# EAGLE design PIC32 (EAGLE 7.5.0)
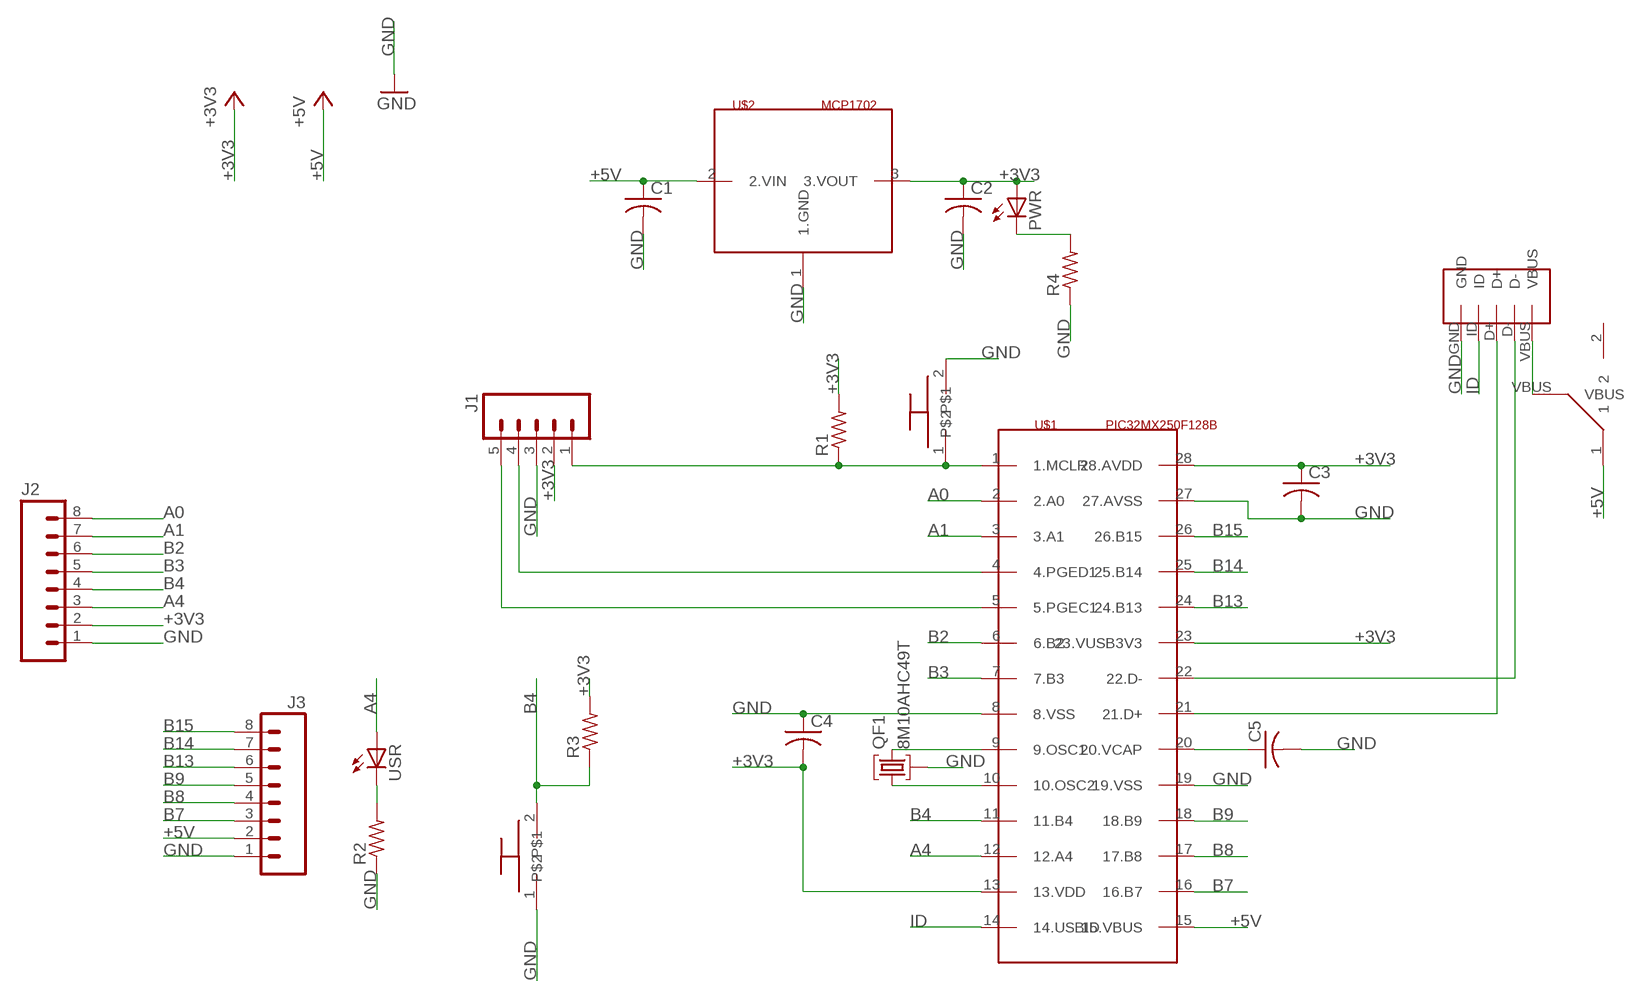
[diagram p0: schematic, sheet 1]

## Parts
C1  C-US025-024X044  [C025-024X044]
C2  C-US025-024X044  [C025-024X044]
C3  C-US025-024X044  [C025-024X044]
C4  C-US025-024X044  [C025-024X044]
C5  C-US025-030X050  [C025-030X050]
J1  M05PTH  [1X05]
J2  M08  [1X08_ROUND]
J3  M08  [1X08_ROUND]
PWR  LED3MM  [LED3MM]
QF1  8M10AHC49T  [HC49U]
R1  R-US_0207/10  [0207/10]
R2  R-US_0207/10  [0207/10]
R3  R-US_0207/10  [0207/10]
R4  R-US_0207/10  [0207/10]
RESET  PUSHBUTTON  [PUSHBUTTON]
U$1  PIC32MX250F128B  [DIL28-3]
U$2  MCP1702  [TO92-EBC]
U$4  USB  [USB-MB-H]
U$6  SLIDESWITCH  [SLIDESWITCH]
USER  PUSHBUTTON  [PUSHBUTTON]
USR  LED3MM  [LED3MM]

## Nets
+3V3: C2.1 C3.1 C4.2 J1.2 J2.2 PWR.A R1.2 R3.2 U$1.13(13.VDD) U$1.23(23.VUSB3V3) U$1.28(28.AVDD) U$2.3(3.VOUT)
+5V: C1.1 J3.2 U$1.15(15.VBUS) U$2.2(2.VIN) U$6.1
A0: J2.8 U$1.2(2.A0)
A1: J2.7 U$1.3(3.A1)
A4: J2.3 U$1.12(12.A4) USR.A
B2: J2.6 U$1.6(6.B2)
B3: J2.5 U$1.7(7.B3)
B4: J2.4 R3.1 U$1.11(11.B4) USER.2
B7: J3.3 U$1.16(16.B7)
B8: J3.4 U$1.17(17.B8)
B9: J3.5 U$1.18(18.B9)
B13: J3.6 U$1.24(24.B13)
B14: J3.7 U$1.25(25.B14)
B15: J3.8 U$1.26(26.B15)
GND: C1.2 C2.2 C3.2 C4.1 C5.2 J1.3 J2.1 J3.1 QF1.2 R2.1 R4.1 RESET.2 U$1.8(8.VSS) U$1.19(19.VSS) U$1.27(27.AVSS) U$2.1(1.GND) U$4.GND USER.1
ID: U$1.14(14.USBID) U$4.ID
N$1: J1.1 R1.1 RESET.1 U$1.1(1.MCLR)
N$2: J1.4 U$1.4(4.PGED1)
N$3: J1.5 U$1.5(5.PGEC1)
N$4: QF1.1 U$1.10(10.OSC2)
N$5: C5.1 U$1.20(20.VCAP)
N$6: R2.2 USR.K(C)
N$7: U$4.VBUS U$6.VBUS
N$8: QF1.3 U$1.9(9.OSC1)
N$9: U$1.21(21.D+) U$4.D+
N$10: U$1.22(22.D-) U$4.D-
N$11: PWR.K(C) R4.2
Unconnected: U$6.2

## Library data of the parts
C1-C5 = ME433:C-US: CAPACITOR, American symbol
J1 = ME433:M05: Header 5 Standard 5-pin 0.1" header. Use with straight break away headers (SKU : PRT-00116), right angle break away headers (PRT-00553), swiss pins (PRT-00743), machine pins (PRT-00117), and female headers (PRT-00115). Molex polarized connector foot print use with SKU : PRT-08230 with associated crimp pins and housings.
J2 J3 = ME433:M08: Header 8 Standard 8-pin 0.1" header. Use with straight break away headers (SKU : PRT-00116), right angle break away headers (PRT-00553), swiss pins (PRT-00743), machine pins (PRT-00117), and female headers (PRT-00115).; PROD_ID: CONN-08437
PWR USR = led:LED: LED OSRAM: - CHIPLED LG R971, LG N971, LY N971, LG Q971, LY Q971, LO R971, LY R971 LH N974, LH R974 LS Q976, LO Q976, LY Q976 LO Q996 - Hyper CHIPLED LW Q18S LB Q993, LB Q99A, LB R99A - SideLED LS A670, LO A670, LY A670, LG A670, LP A670 LB A673, LV A673, LT A673, LW A673 LH A674 LY A675 LS A676, LA A676, LO A676, LY A676, LW A676 LS A679, LY A679, LG A679 - Hyper Micro SIDELED® LS Y876, LA Y876, LO Y876, LY Y876 LT Y87S - SmartLED LW L88C, LW L88S LB L89C, LB L89S, LG L890 LS L89K, LO L89K, LY L89K LS L896, LA L896, LO L896, LY L896 - TOPLED LS T670, LO T670, LY T670, LG T670, LP T670 LSG T670, LSP T670, LSY T670, LOP T670, LYG T670 LG T671, LOG T671, LSG T671 LB T673, LV T673, LT T673, LW T673 LH T674 LS T676, LA T676, LO T676, LY T676, LB T676, LH T676, LSB T676, LW T676 LB T67C, LV T67C, LT T67C, LS T67K, LO T67K, LY T67K, LW E67C LS E67B, LA E67B, LO E67B, LY E67B, LB E67C, LV E67C, LT E67C LW T67C LS T679, LY T679, LG T679 LS T770, LO T770, LY T770, LG T770, LP T770 LB T773, LV T773, LT T773, LW T773 LH T774 LS E675, LA E675, LY E675, LS T675 LS T776, LA T776, LO T776, LY T776, LB T776 LHGB T686 LT T68C, LB T68C - Hyper Mini TOPLED® LB M676 - Mini TOPLED Santana® LG M470 LS M47K, LO M47K, LY M47K Source: http://www.osram.convergy.de LUXEON: - LUMILED® LXK2-PW12-R00, LXK2-PW12-S00, LXK2-PW14-U00, LXK2-PW14-V00 LXK2-PM12-R00, LXK2-PM12-S00, LXK2-PM14-U00 LXK2-PE12-Q00, LXK2-PE12-R00, LXK2-PE12-S00, LXK2-PE14-T00, LXK2-PE14-U00 LXK2-PB12-K00, LXK2-PB12-L00, LXK2-PB12-M00, LXK2-PB14-N00, LXK2-PB14-P00, LXK2-PB14-Q00 LXK2-PR12-L00, LXK2-PR12-M00, LXK2-PR14-Q00, LXK2-PR14-R00 LXK2-PD12-Q00, LXK2-PD12-R00, LXK2-PD12-S00 LXK2-PH12-R00, LXK2-PH12-S00 LXK2-PL12-P00, LXK2-PL12-Q00, LXK2-PL12-R00 Source: www.luxeon.com KINGBRIGHT: KA-3528ASYC Source: www.kingbright.com
QF1 = ME433:8M10AHC49T: Monolithic Crystal Filters Source: www.vanlong.com; OC_FARNELL: unknown; OC_NEWARK: unknown
R1-R4 = ME433:R-US_: RESISTOR, American symbol
RESET USER = ME433:PUSHBUTTON
U$1 = ME433:PIC32MX250F128B
U$2 = ME433:MCP1702
U$4 = ME433:USB
U$6 = ME433:SLIDESWITCH

## Board
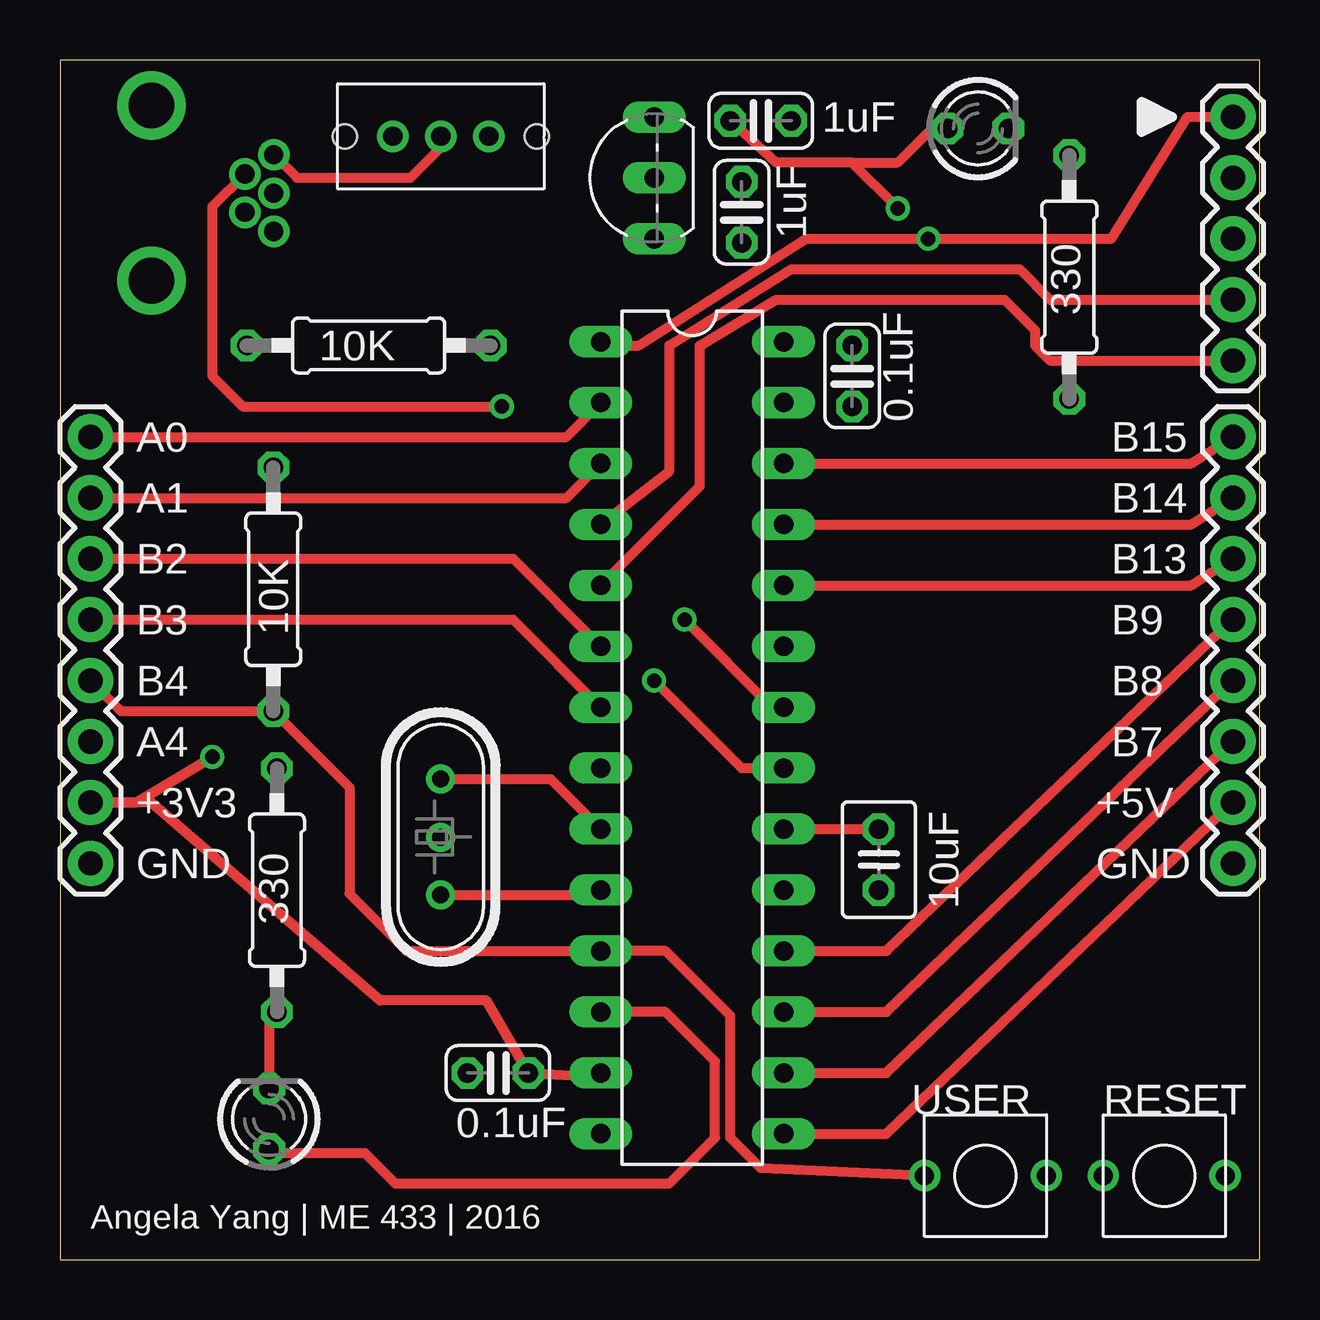
[diagram p1: board, top side]
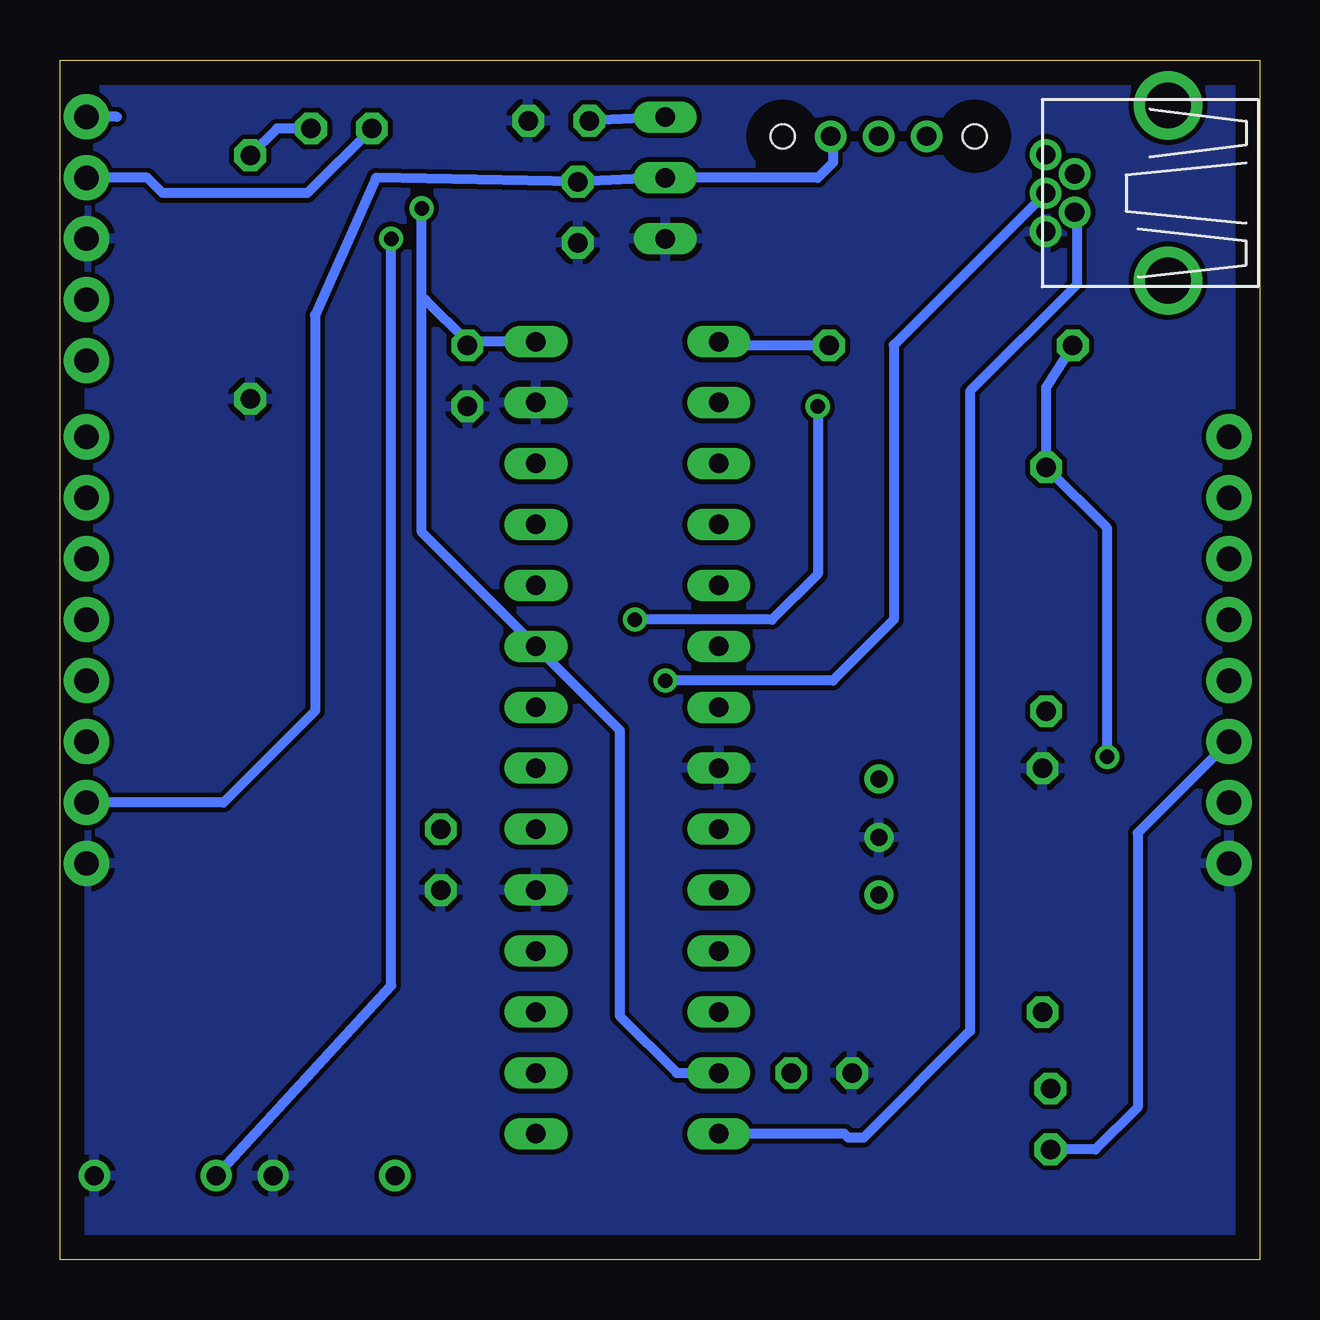
[diagram p2: board, bottom side, seen from below]

Size 50 x 50 mm. Coordinates in mm from the lower left corner, seen from the top.
Outline: 0,0 50,0 50,50 0,50 0,0
Copper layers (1*16): Top 0.035mm / dielectric 1.5mm / Bottom 0.035mm
Design rules "default": minimum track width 10mil, minimum drill 24mil, track to track 8mil, track to pad 8mil, pad to pad 8mil, via to via 8mil, smd to smd 8mil, copper to edge 40mil, drill to drill 8mil, minimum pad ring 10mil, minimum via ring 8mil, stop-mask expansion 4mil, vias tented up to drill 0mil, thermal gap 10mil

### Footprints (pad centres in the part's own frame; a part is rotated, then mirrored left to right if it is on the bottom)
C025-024X044 = drill 0.813 octagon: 1 -1.27,0; 2 1.27,0
C025-030X050 = drill 0.813 octagon: 1 -1.27,0; 2 1.27,0
1X05 = drill 1.016 pad 1.88: 1 0,0; 2 2.54,0; 3 5.08,0; 4 7.62,0; 5 10.16,0
1X08_ROUND = drill 1.016 pad 1.88: 1 0,0; 2 2.54,0; 3 5.08,0; 4 7.62,0; 5 10.16,0; 6 12.7,0; 7 15.24,0; 8 17.78,0
LED3MM = drill 0.813 octagon: A -1.27,0; K 1.27,0
HC49U = drill 0.7 pad 1.2: 1 -2.413,0; 2 -0.027,0; 3 2.413,0
0207/10 = drill 0.813 octagon: 1 -5.08,0; 2 5.08,0
PUSHBUTTON = drill 0.8: 1 -2.54,0; 2 2.54,0
DIL28-3 = drill 0.813 long: 1 -16.51,-3.81; 2 -13.97,-3.81; 3 -11.43,-3.81; 4 -8.89,-3.81; 5 -6.35,-3.81; 6 -3.81,-3.81; 7 -1.27,-3.81; 8 1.27,-3.81; 9 3.81,-3.81; 10 6.35,-3.81; 11 8.89,-3.81; 12 11.43,-3.81; 13 13.97,-3.81; 14 16.51,-3.81; 15 16.51,3.81; 16 13.97,3.81; 17 11.43,3.81; 18 8.89,3.81; 19 6.35,3.81; 20 3.81,3.81; 21 1.27,3.81; 22 -1.27,3.81; 23 -3.81,3.81; 24 -6.35,3.81; 25 -8.89,3.81; 26 -11.43,3.81; 27 -13.97,3.81; 28 -16.51,3.81
TO92-EBC = drill 0.813 long: 1 -2.54,-1.27; 2 0,-1.27; 3 2.54,-1.27
USB-MB-H = drill 0.8: D+ 5.1,0; D- 3.9,0.8; GND 5.1,-1.6; ID 3.9,-0.8; VBUS 5.1,1.6 | drill 1.9: P$6 0,-3.65; P$7 0,3.65
SLIDESWITCH = drill 0.8: 1 -2,0; 2 2,0; VBUS 0,0 | hole 1: -4,0; 4,0

### Placement (x,y rotation side)
C1  28.41,43.66 270 top
C2  29.21,47.47 0 top
C3  33.02,36.83 270 top
C4  18.25,7.78 0 top
C5  34.13,16.67 270 top
J1  48.9,47.63 270 top
J2  1.27,16.51 90 top
J3  48.9,16.51 90 top
PWR  38.27,47.15 0 top
QF1  15.87,17.61 90 top
R1  12.87,38.1 180 top
R2  9.04,15.39 270 top
R3  8.89,27.94 90 top
R4  42.07,40.95 90 top
RESET  46.03,3.5 0 top
U$1  26.35,21.75 270 top
U$2  23.5,45.09 90 top
U$4  3.81,44.45 0 top
U$6  15.88,46.82 180 top
USER  38.58,3.5 180 top
USR  8.71,5.86 90 top

### Tracks (layer width: path | path; a pad name or v marks a point on that pad's centre or on a via)
+3V3  (via drill 0.6)
  Top 0.406: U$1.13 22.38,7.62 C4.2 17.78,10.79 13.34,10.79 3.81,19.05 J2.2 3.17,19.05 v6.35,20.95 | C2.1 29.84,45.72 33.02,45.72 | 33.02,45.72 34.92,45.72 36.35,47.15 PWR.A | v34.92,43.81 33.02,45.72
  Bottom 0.406: U$1.28 33.02,38.26 | 33.02,38.26 C3.1 | R1.2 8.89,36.36 R3.2 6.35,30.48 v6.35,20.95 | U$2.3 C2.1 | PWR.A 39.69,44.45 45.72,44.45 46.36,45.09 J1.2 | U$1.13 24.29,7.78 26.67,10.16 26.67,22.07 U$1.23 34.92,30.32 34.92,40 | 34.92,40 v34.92,43.81 | 33.02,38.26 34.76,40 34.92,40
+5V
  Top 0.406: U$1.15 34.45,5.24 J3.2
  Bottom 0.406: U$6.1 17.78,46.73 17.78,45.72 18.41,45.09 U$2.2 C1.1 36.83,45.09 39.37,39.37 39.37,22.86 43.18,19.05 J3.2
A0
  Top 0.406: J2.8 21.11,34.29 U$1.2
A1
  Top 0.406: J2.7 21.11,31.75 U$1.3
A4
  Top 0.406: USR.A 8.86,4.45 12.7,4.45 13.97,3.17 25.4,3.17 27.3,5.08 27.3,8.26 25.24,10.32 U$1.12
  Bottom 0.406: J2.3 5.08,17.78 5.08,6.35 6.84,4.59 USR.A
B2
  Top 0.406: J2.6 18.89,29.21 U$1.6
B3
  Top 0.406: J2.5 18.89,26.67 U$1.7
B4
  Top 0.406: J2.4 2.54,22.86 R3.1 12.06,19.68 12.06,15.24 14.45,12.86 U$1.11 25.24,12.86 27.94,10.16 27.94,5.08 29.21,3.81 USER.2
B7
  Top 0.406: U$1.16 34.45,7.78 J3.3
B8
  Top 0.406: U$1.17 34.45,10.32 J3.4
B9
  Top 0.406: U$1.18 34.45,12.86 J3.5
B13
  Top 0.406: U$1.24 47.15,28.1 J3.6
B14
  Top 0.406: U$1.25 47.15,30.64 J3.7
B15
  Top 0.406: U$1.26 47.15,33.18 J3.8
GND
  pour Bottom: 0,0 0,50 50,50 50,0
ID
  Bottom 0.406: U$4.ID 7.62,43.56 7.62,40.64 12.06,36.2 12.06,9.53 16.51,5.08 17.14,5.08 17.3,5.24 U$1.14
N$1  (via drill 0.6)
  Top 0.406: U$1.1 22.7,38.1 24.13,38.1 31.11,42.55 v36.2,42.55 43.81,42.55 46.99,47.63 J1.1
  Bottom 0.406: R1.1 22.54,38.1 U$1.1 | 47.63,47.63 J1.1 | RESET.1 36.2,11.43 v36.2,42.55
N$2
  Top 0.406: U$1.4 25.4,32.87 25.4,38.1 30.48,41.27 40.01,41.27 41.27,40.01 J1.4
N$3
  Top 0.406: U$1.5 26.67,32.23 26.67,38.1 29.84,40.01 39.37,40.01 40.64,38.73 40.64,38.1 41.27,37.47 J1.5
N$4
  Top 0.406: QF1.1 22.34,15.2 U$1.10
N$5
  Top 0.406: U$1.20 C5.1
N$6
  Top 0.406: R2.2 8.71,9.98 USR.K
N$7
  Top 0.406: U$4.VBUS 9.88,45.09 14.61,45.09 15.88,46.35 U$6.VBUS
N$8
  Top 0.406: QF1.3 20.45,20.03 U$1.9
N$9  (via drill 0.6)
  Top 0.406: v24.77,24.13 28.41,20.48 U$1.21
  Bottom 0.406: U$4.D+ 15.24,38.12 15.24,26.67 17.78,24.13 v24.77,24.13
N$10  (via drill 0.6)
  Top 0.406: U$4.D- 6.35,43.89 6.35,36.83 7.62,35.56 v18.41,35.56 | v26.04,26.67 29.68,23.02 U$1.22
  Bottom 0.406: v18.41,35.56 18.41,28.57 20.32,26.67 v26.04,26.67
N$11
  Bottom 0.406: PWR.K 40.95,47.15 R4.2

### Text on the board
tNames: 1uF | 1uF | 10K | 330 | 0.1uF | A0 | B15 | A1 | B14 | B2 | 10K | B13 | B3 | B9 | B4 | B8 | A4 | B7 | +3V3 | +5V | GND | GND | 10uF | 330 | 0.1uF | Angela Yang | ME 433 | 2016